# Altium schematic sheet 3_语音模块.schdoc.schdoc
size 309 x 223 mm; Symbol: Sheet-Symbol_A4; Device: Sheet-Symbol_A4; @Page Name: 语音模块; @Create Date: 2023-10-28; @Page Count: 4; @Page No: 2; @Project Name: New Project_2023-10-25_23-03-02; @Schematic Name: Schematic1; @Update Date: 2023-11-07; Company: 嘉立创EDA; Page Size: A4; Version: V1.0; SheetNumber: 2; SheetTotal: 4
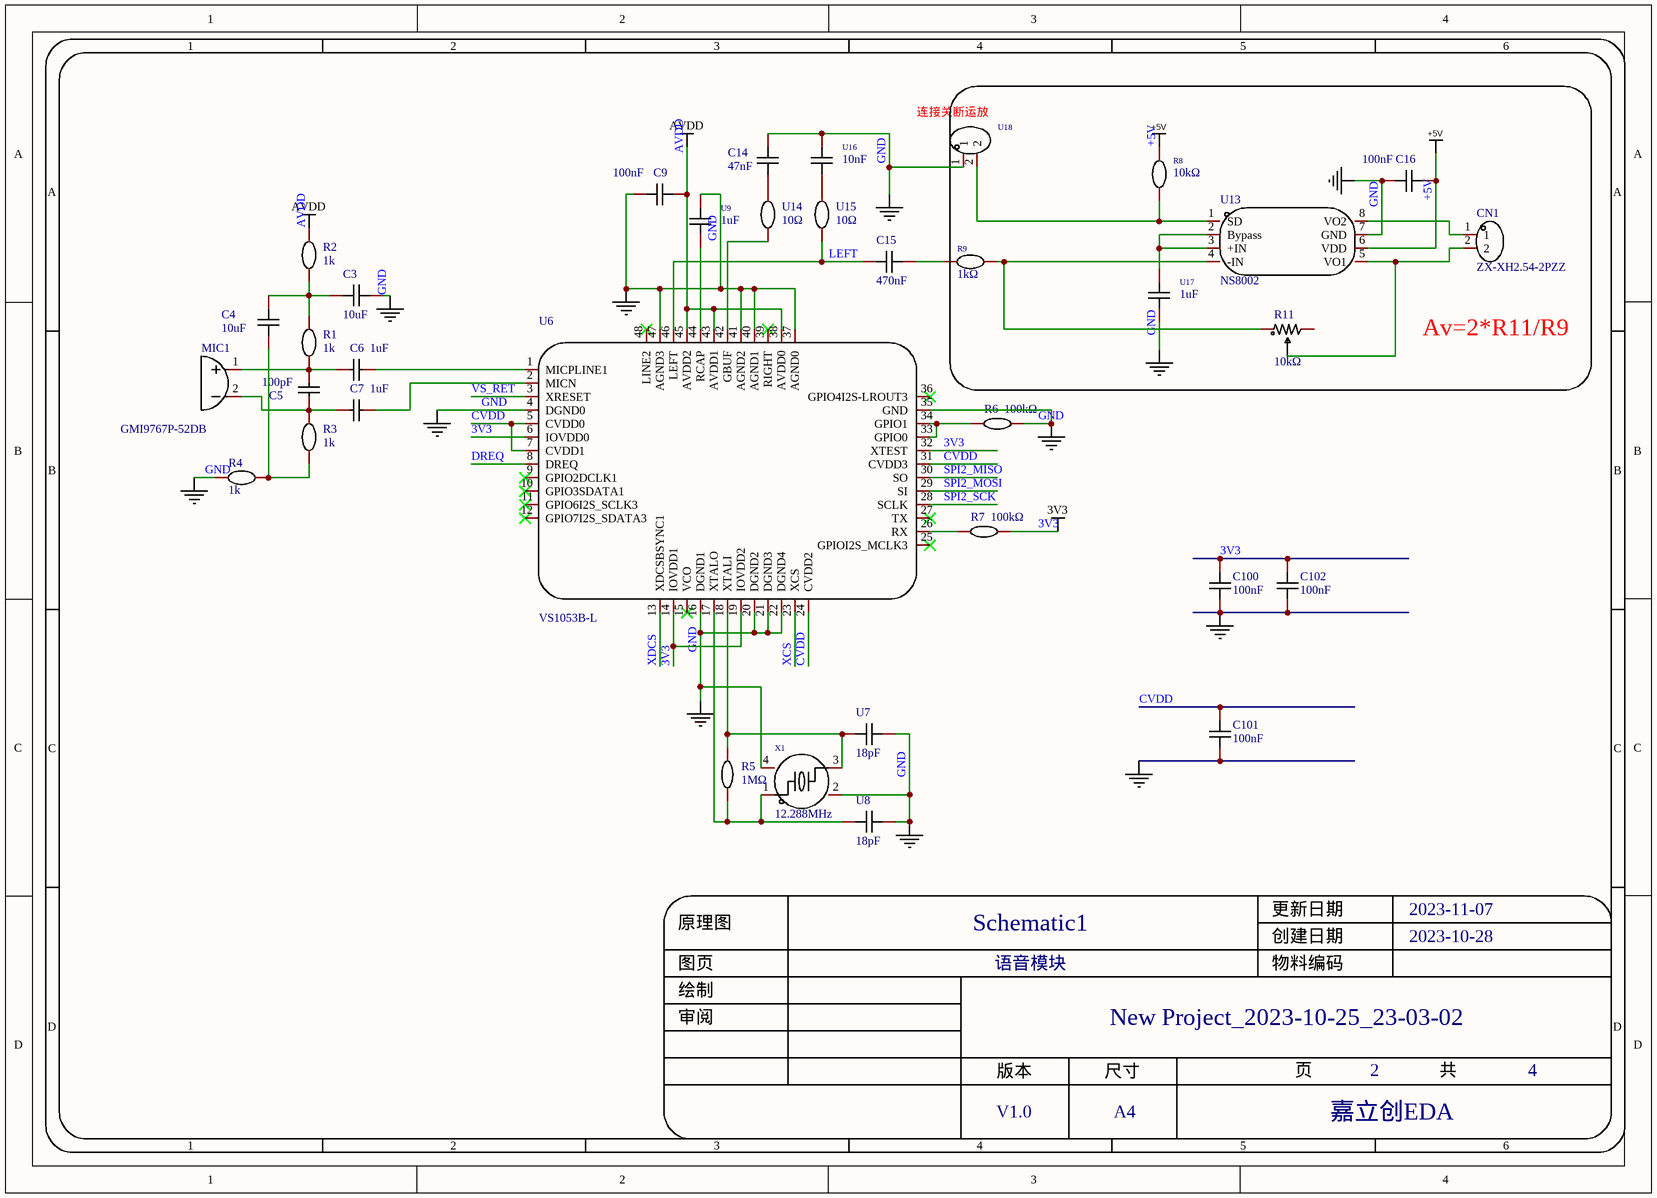
[diagram p0: 3_语音模块.schdoc.schdoc]

## Parts
C3  10uF  [C0603]
C4  10uF  [C0603]
C5  100pF  [C0603]
C6  1uF  [C0603]
C7  1uF  [C0603]
C9  100nF  [C0603]
C14  47nF  [C0603]
C15  470nF  [C0805]
C16  100nF  [C0603]
C100  100nF  [C0603]
C101  100nF  [C0603]
C102  100nF  [C0603]
CN1  ZX-XH2.54-2PZZ  [CONN-TH_2P-P2.50_HX25003-2A]
MIC1  GMI9767P-52DB  [MIC-TH_BD9.7-P2.54-D0.8-L-FD]
R1  1k  [R0603]
R2  1k  [R0603]
R3  1k  [R0603]
R4  1k  [R0603]
R5  1MΩ  [R0603]
R6  100kΩ  [R0603]
R7  100kΩ  [R0603]
R8  10kΩ  [R0603]
R9  1kΩ  [R0603]
R11  10kΩ  [RES-ADJ-TH_3362P]
U6  VS1053B-L  [LQFP-48_L7.0-W7.0-P0.50-LS9.0-BL]
U7  18pF  [C0603]
U8  18pF  [C0603]
U9  1uF  [C0603]
U13  NS8002  [SOP-8_L4.9-W3.9-P1.27-LS6.0-BL]
U14  10Ω  [R0603]
U15  10Ω  [R0603]
U16  10nF  [C0603]
U17  1uF  [C0603]
U18  PZ200-1-02-Z-C  [HDR-TH_2P-P2.00-V-M-3]  (value not drawn)
X1  12.288MHz  [CRYSTAL-SMD_4P-L3.2-W2.5-BL]

## Blocks framed on the sheet
Av=2*R11/R9: C16 CN1 R8 R9 R11 U13 U17 U18

## Nets
3V3: C100.1 C102.1 R7.2 U6.6(IOVDD0) U6.14(IOVDD1) U6.19(IOVDD2) U6.32(XTEST)
+5V: C16.1 R8.2 U13.6(VDD)
AVDD: C9.1 R2.2 U6.38(AVDD0) U6.43(AVDD1) U6.45(AVDD2)
GND: C3.2 C9.2 C14.2 C16.2 C100.2 C101.2 C102.2 R4.2 R6.2 U6.4(DGND0) U6.16(DGND1) U6.20(DGND2) U6.21(DGND3) U6.22(DGND4) U6.35(GND) U6.37(AGND0) U6.40(AGND1) U6.41(AGND2) U6.47(AGND3) U7.2 U8.2 U9.2 U13.7(GND) U16.2 U17.1 U18.1 X1.2(GND) X1.4(GND)
CVDD: C101.1 U6.5(CVDD0) U6.7(CVDD1) U6.24(CVDD2) U6.31(CVDD3)
DREQ: U6.8(DREQ)
LEFT: C15.1 U6.46(LEFT) U15.1
SPI2_MISO: U6.30(SO)
SPI2_MOSI: U6.29(SI)
SPI2_SCK: U6.28(SCLK)
VS_RET: U6.3(XRESET)
XCS: U6.23(XCS)
XDCS: U6.13(XDCSBSYNC1)
NetC3_1: C3.1 C4.2 R1.2 R2.1
NetC4_1: C4.1 R3.1 R4.1
NetC5_1: C5.1 C7.1 MIC1.2 R3.2
NetC5_2: C5.2 C6.1 MIC1.1 R1.1
NetC6_2: C6.2 U6.1(MICPLINE1)
NetC7_2: C7.2 U6.2(MICN)
NetC14_1: C14.1 U14.2
NetC15_2: C15.2 R9.1
NetCN1_1: CN1.1 U13.8(VO2)
NetCN1_2: CN1.2 R11.2 U13.5(VO1)
NetR5_1: R5.1 U6.17(XTALO) U8.1 X1.1
NetR5_2: R5.2 U6.18(XTALI) U7.1 X1.3
NetR6_1: R6.1 U6.33(GPIO0) U6.34(GPIO1)
NetR7_1: R7.1 U6.26(RX)
NetR8_1: R8.1 U13.1(SD) U18.2
NetR9_2: R9.2 R11.1 U13.4(-IN)
NetU6_42: U6.42(GBUF) U14.1
NetU6_44: U6.44(RCAP) U9.1
NetU13_2: U13.2(Bypass) U13.3(+IN) U17.2
NetU15_2: U15.2 U16.1

Not connected (* = marked no-connect by the designer): R11 3; U6 9(GPIO2DCLK1)* 10(GPIO3SDATA1)* 11(GPIO6I2S_SCLK3)* 12(GPIO7I2S_SDATA3)* 15(VCO)* 25(GPIOI2S_MCLK3)* 27(TX)* 36(GPIO4I2S-LROUT3)* 39(RIGHT)* 48(LINE2)*

## Notes on the sheet
- (near U18) 连接关断运放
- 1
- 2
- 3
- 4
- 5
- 6
- A
- B
- C
- 原理图
- Schematic1
- 创建日期
- 更新日期
- 2023-10-28
- 2023-11-07
- 审阅
- 绘制
- 图页
- 语音模块
- 物料编码
- New Project_2023-10-25_23-03-02
- D
- 版本
- 尺寸
- 页
- 共
- V1.0
- A4
- 嘉立创EDA

## Library data of the parts
C3 C4 = CL10A106MA8NRNC: 容值:10uF;精度:±20%;额定电压:25V;材质(温度系数):X5R;; Manufacturer: SAMSUNG(三星); Add into BOM: yes; Tolerance: ±20%; Voltage Rated: 25V; Temperature Coefficient: X5R; Name: 10uF; Symbol: CL10A106MA8NRNC; Device: CL10A106MA8NRNC; LCSC Part Name: 10uF ±20% 25V; Supplier Part: C96446; Manufacturer Part: CL10A106MA8NRNC; Supplier Footprint: 0603; JLCPCB Part Class: 基础库; Datasheet: https://atta.szlcsc.com/upload/public/pdf/source/20170325/1490427913016.pdf; Supplier: LCSC; Convert to PCB: yes; Value: 10uF
C5 = CL10C101JB8NNNC: 容值:100pF;精度:±5%;额定电压:50V;材质(温度系数):C0G;; Manufacturer: SAMSUNG(三星); Add into BOM: yes; Tolerance: ±5%; Voltage Rated: 50V; Temperature Coefficient: C0G; Name: 100pF; Symbol: CL10C101JB8NNNC; Device: CL10C101JB8NNNC; LCSC Part Name: 100pF ±5% 50V; Supplier Part: C14858; Manufacturer Part: CL10C101JB8NNNC; Supplier Footprint: 0603; JLCPCB Part Class: 基础库; Datasheet: https://atta.szlcsc.com/upload/public/pdf/source/20160103/1457707672333.pdf; Supplier: LCSC; Convert to PCB: yes; Value: 100pF
C6 C7 = CL10A105KB8NNNC: 容值:1uF;精度:±10%;额定电压:50V;材质(温度系数):X5R;; Manufacturer: SAMSUNG(三星); Add into BOM: yes; Tolerance: ±10%; Voltage Rated: 50V; Temperature Coefficient: X5R; Name: 1uF; Symbol: CL10A105KB8NNNC; Device: CL10A105KB8NNNC; LCSC Part Name: 1uF ±10% 50V; Supplier Part: C15849; Manufacturer Part: CL10A105KB8NNNC; Supplier Footprint: 0603; JLCPCB Part Class: 基础库; Datasheet: https://atta.szlcsc.com/upload/public/pdf/source/20160103/1457707679084.pdf; Supplier: LCSC; Convert to PCB: yes; Value: 1uF
C9 C16 C100-C102 = CGA3E3X8R1H104M080AE: 容值:100nF;精度:±20%;额定电压:50V;材质(温度系数):X8R;; Manufacturer: TDK; Add into BOM: yes; Tolerance: ±20%; Voltage Rated: 50V; Temperature Coefficient: X8R; Name: 100nF; Symbol: CGA3E3X8R1H104M080AE; Device: CGA3E3X8R1H104M080AE; LCSC Part Name: 100nF ±20% 50V; Supplier Part: C3855738; Manufacturer Part: CGA3E3X8R1H104M080AE; Supplier Footprint: 0603; Supplier: LCSC; Convert to PCB: yes; Value: 100nF
C14 = C1608X8R1H473K080AA: 容值:47nF;额定电压:50V;材质(温度系数):X8R;; Manufacturer: TDK; Add into BOM: yes; Voltage Rated: 50V; Temperature Coefficient: X8R; Name: 47nF; Symbol: C1608X8R1H473K080AA; Device: C1608X8R1H473K080AA; LCSC Part Name: 47nF 50V; Supplier Part: C3890694; Manufacturer Part: C1608X8R1H473K080AA; Supplier Footprint: 0603; Supplier: LCSC; Convert to PCB: yes; Value: 47nF
C15 = CC0805KKX7R0BB474: 容值:470nF;精度:±10%;额定电压:100V;材质(温度系数):X7R;; Manufacturer: YAGEO(国巨); Symbol: GRM21BR60E107ME15L; Add into BOM: yes; Tolerance: ±10%; Voltage Rated: 100V; Temperature Coefficient: X7R; Name: 470nF; Device: CC0805KKX7R0BB474; LCSC Part Name: 470nF ±10% 100V; Supplier Part: C596323; Manufacturer Part: CC0805KKX7R0BB474; Supplier Footprint: 0805; JLCPCB Part Class: Extended Part; Datasheet: https://atta.szlcsc.com/upload/public/pdf/source/20200609/C596323_82E7DD20666BC3809E26A1262184D295.pdf; Supplier: LCSC; Convert to PCB: yes; Value: 470nF
CN1 = ZX-XH2.54-2PZZ: 参考系列:XH;间距:2.54mm;插针结构:1x2P;排数:1;每排PIN数:2;行距:-;公母:公型插针;安装方式:直插;额定电流:3A;触头材质:黄铜;触头镀层:锡;工作温度范围:-25℃~+85℃;焊接温度(最大值):260℃;; Manufacturer: Megastar(兆星); Add into BOM: yes; Reference Series: XH; Pitch: 2.54mm; Pins Structure: 1x2P; Number of PINs Per Row: 2; Gender: 公型插针; Current Rating (Max): 3A; Welding Temperature (Max): 260℃; Name: ZX-XH2.54-2PZZ; Symbol: ZX-XH2.54-2PZZ; Device: ZX-XH2.54-2PZZ; LCSC Part Name: 系列:XH 间距:2.54mm 1x2P 直插; Supplier Part: C7429632; Manufacturer Part: ZX-XH2.54-2PZZ; Supplier Footprint: 插件,P=2.54mm; JLCPCB Part Class: 扩展库; Datasheet: https://atta.szlcsc.com/upload/public/pdf/source/20230619/19BA6947230AA44A04D3EDD65E618FD0.pdf; Supplier: LCSC; Convert to PCB: yes; Number of Rows: 1; Row Spacing: -; Mounting Style: 直插; Contact Material: 黄铜; Contact Plating: 锡; Operating Temperature Range: -25℃~+85℃
MIC1 = GMI9767P-52DB: Manufacturer: INGHAi(赢海); Add into BOM: yes; Name: GMI9767P-52DB; Symbol: GMI9767P-52DB; Device: GMI9767P-52DB; LCSC Part Name: 全指向φ9.7*6.7mm 1.5V-10V 灵敏度-52db 低阻抗 针脚; Supplier Part: C234023; Manufacturer Part: GMI9767P-52DB; Supplier Footprint: 插件; JLCPCB Part Class: 扩展库; Datasheet: https://atta.szlcsc.com/upload/public/pdf/source/20200113/C234023_1CE1EA91B70FB2D654251C10F12F6FAC.pdf; Supplier: LCSC; Convert to PCB: yes
R1-R4 = 1k: Add into BOM: yes; Name: 1k; Symbol: 1K; Device: 1k; LCSC Part Name: 1k; Supplier Part: C9900012840; Manufacturer Part: 1k; Supplier Footprint: R0603; JLCPCB Part Class: 扩展库; Supplier: LCSC; Convert to PCB: yes
R5 = 0603WAF1004T5E: 电阻类型:厚膜电阻;阻值:1MΩ;精度:±1%;功率:100mW;温度系数:±100ppm/℃;; Manufacturer: UNI-ROYAL(厚声); Add into BOM: yes; Tolerance: ±1%; Power(Watts): 100mW; Overload Voltage (Max): 75V; Name: 1MΩ; Symbol: 0603WAF1004T5E; Device: 0603WAF1004T5E; LCSC Part Name: 厚膜电阻 1MΩ ±1% 100mW; Supplier Part: C22935; Manufacturer Part: 0603WAF1004T5E; Supplier Footprint: 0603; JLCPCB Part Class: 基础库; Datasheet: https://atta.szlcsc.com/upload/public/pdf/source/20200306/C422600_1E6D84923E4A46A82E41ADD87F860B5C.pdf; Supplier: LCSC; Convert to PCB: yes; Type: 厚膜电阻; Value: 1MΩ; Temperature Coefficient: ±100ppm/℃; Operating Temperature Range: -55℃~+155℃
R6 R7 = ERJ3EKF1003V: 电阻类型:厚膜电阻;阻值:100kΩ;精度:±1%;功率:100mW;温度系数:±100ppm/℃;; Manufacturer: PANASONIC(松下); Add into BOM: yes; Tolerance: ±1%; Power(Watts): 100mW; Name: 100kΩ; Symbol: ERJ3EKF1003V; Device: ERJ3EKF1003V; LCSC Part Name: 厚膜电阻 100kΩ ±1% 100mW; Supplier Part: C189597; Manufacturer Part: ERJ3EKF1003V; Supplier Footprint: 0603; JLCPCB Part Class: 扩展库; Datasheet: https://atta.szlcsc.com/upload/public/pdf/source/20180524/C193239_FFEA89BB7F9859C8C42240F47AD03C60.pdf; Supplier: LCSC; Convert to PCB: yes; Type: 厚膜电阻; Value: 100kΩ; Temperature Coefficient: ±100ppm/℃; Overload Voltage (Max): -; Operating Temperature Range: -55℃~+155℃
R8 = SCR0603J10K: 阻值:10kΩ;精度:±5%;; Manufacturer: VO(翔胜); Add into BOM: yes; Tolerance: ±5%; Name: 10kΩ; Symbol: SCR0603J10K; Device: SCR0603J10K; LCSC Part Name: 10kΩ ±5%; Supplier Part: C3017715; Manufacturer Part: SCR0603J10K; Supplier Footprint: 0603; JLCPCB Part Class: 扩展库; Datasheet: https://atta.szlcsc.com/upload/public/pdf/source/20220513/247AF9639BA21CF93567DC289CCC6A22.pdf; Supplier: LCSC; Convert to PCB: yes; Value: 10kΩ
R9 = SCR0603F1K: 阻值:1kΩ;精度:±1%;; Manufacturer: VO(翔胜); Add into BOM: yes; Tolerance: ±1%; Name: 1kΩ; Symbol: SCR0603F1K; Device: SCR0603F1K; LCSC Part Name: 1kΩ ±1%; Supplier Part: C3016283; Manufacturer Part: SCR0603F1K; Supplier Footprint: 0603; JLCPCB Part Class: 扩展库; Datasheet: https://atta.szlcsc.com/upload/public/pdf/source/20220513/247AF9639BA21CF93567DC289CCC6A22.pdf; Supplier: LCSC; Convert to PCB: yes; Value: 1kΩ
R11 = 3362P-1-103: 阻值:10kΩ;精度:±10%;; Manufacturer: BOCHEN(博晨); Symbol: 3362P-1-103_C118956; Add into BOM: yes; Tolerance: ±10%; Name: 10kΩ; Device: 3362P-1-103; LCSC Part Name: 10kΩ ±10%; Supplier Part: C118956; Manufacturer Part: 3362P-1-103; Supplier Footprint: 插件; JLCPCB Part Class: 扩展库; Datasheet: https://atta.szlcsc.com/upload/public/pdf/source/20171114/C118956_15106326650691117445.pdf; Supplier: LCSC; Convert to PCB: yes; Value: 10kΩ
U6 = VS1053B-L: MP3芯片; Manufacturer: VLSI; Add into BOM: yes; Name: VS1053B-L; Symbol: VS1053B; Device: VS1053B-L; LCSC Part Name: VS1053B-L; Supplier Part: C9922; Manufacturer Part: VS1053B-L; Supplier Footprint: LQFP-48(7x7); JLCPCB Part Class: 扩展库; Datasheet: https://atta.szlcsc.com/upload/public/pdf/source/20121114/1457706558124.pdf; Supplier: LCSC; Convert to PCB: yes
U7 U8 = C1608CH2A180J080AA: 容值:18pF;精度:±5%;额定电压:100V;材质(温度系数):CH;; Manufacturer: TDK; Add into BOM: yes; Tolerance: ±5%; Voltage Rated: 100V; Temperature Coefficient: CH; Name: 18pF; Symbol: C1608CH2A180J080AA; Device: C1608CH2A180J080AA; LCSC Part Name: 18pF ±5% 100V; Supplier Part: C3847790; Manufacturer Part: C1608CH2A180J080AA; Supplier Footprint: -; JLCPCB Part Class: 扩展库; Supplier: LCSC; Convert to PCB: yes; Value: 18pF
U9 U17 = CGA3E3X5R1V105M080AB: 容值:1uF;精度:±20%;额定电压:35V;材质(温度系数):X5R;; Manufacturer: TDK; Add into BOM: yes; Tolerance: ±20%; Voltage Rated: 35V; Temperature Coefficient: X5R; Name: 1uF; Symbol: CGA3E3X5R1V105M080AB; Device: CGA3E3X5R1V105M080AB; LCSC Part Name: 1uF ±20% 35V; Supplier Part: C3910162; Manufacturer Part: CGA3E3X5R1V105M080AB; Supplier Footprint: 0603; Supplier: LCSC; Convert to PCB: yes; Value: 1uF
U13 = NS8002: 音频功率放大器的类型:Class AB;输出类型:-;输出功率:1.8W x 1 @ 4Ω;工作电压:3V ~ 5.25V;; Manufacturer: Nsiway(纳芯威); Add into BOM: yes; Name: NS8002; Symbol: NS8002; Device: NS8002; LCSC Part Name: NS8002; Supplier Part: C189960; Manufacturer Part: NS8002; Supplier Footprint: SOP-8-EP-150mil; JLCPCB Part Class: 扩展库; Datasheet: https://atta.szlcsc.com/upload/public/pdf/source/20190704/C189960_42E000A0092060C3B2B5B31BC13BD104.pdf; Supplier: LCSC; Convert to PCB: yes; Type: Class AB; Output Type: -; Max Output Power x Channels @ Load: 1.8W x 1 @ 4Ω; Voltage - Supply: 3V ~ 5.25V; Features: 关机
U14 U15 = PCAN0603E10R0BST5: 电阻类型:薄膜电阻;阻值:10Ω;精度:±0.1%;功率:500mW;; Manufacturer: VISHAY(威世); Add into BOM: yes; Tolerance: ±0.1%; Power(Watts): 500mW; Temperature Coefficient: ±25ppm/℃; Overload Voltage (Max): 75V; Name: 10Ω; Symbol: PCAN0603E10R0BST5; Device: PCAN0603E10R0BST5; LCSC Part Name: 10Ω ±0.1% 500mW; Supplier Part: C2091258; Manufacturer Part: PCAN0603E10R0BST5; Supplier Footprint: 0603; JLCPCB Part Class: 扩展库; Datasheet: https://atta.szlcsc.com/upload/public/pdf/source/20210606/BB102AFC1F3ADA31AF003395293DA88D.pdf; Supplier: LCSC; Convert to PCB: yes; Type: 薄膜电阻; Value: 10Ω; Operating Temperature Range: -55℃~+155℃
U16 = C1608X8R2A103K080AA: 容值:10nF;精度:±10%;额定电压:100V;材质(温度系数):X8R;; Manufacturer: TDK; Add into BOM: yes; Tolerance: ±10%; Voltage Rated: 100V; Temperature Coefficient: X8R; Name: 10nF; Symbol: C1608X8R2A103K080AA; Device: C1608X8R2A103K080AA; LCSC Part Name: 10nF ±10% 100V; Supplier Part: C3865495; Manufacturer Part: C1608X8R2A103K080AA; Supplier Footprint: 0603; Supplier: LCSC; Convert to PCB: yes; Value: 10nF
U18 = PZ200-1-02-Z-C: 间距：2.0mm 总PIN位数：2 排数1行距：2.0mm 安类型：直插 圆针：圆针 额定电流：3A 配合针长度：3.7mm 塑高：3mm 端接针长度：3.7mm 触头材质：黄铜 触头镀层：金 工作温度范围：-40℃~+105℃ 焊接温度(最大值)：260℃ 颜色：黑; Manufacturer: HCTL(华灿天禄); Add into BOM: yes; Name: PZ200-1-02-Z-C; Symbol: PZ200-1-02-Z-C; Device: PZ200-1-02-Z-C; LCSC Part Name: PZ200-1-02-Z-C; Supplier Part: C5159793; Manufacturer Part: PZ200-1-02-Z-C; Supplier Footprint: 插件,P=2mm; JLCPCB Part Class: 扩展库; Datasheet: https://atta.szlcsc.com/upload/public/pdf/source/20230609/CA4823EE069156B840028BF818EA617F.pdf; Supplier: LCSC; Convert to PCB: yes
X1 = SX3B12.288F2010F30: 频率:12.288MHz;频率公差:±10ppm;负载电容:20pF;; Manufacturer: SCTF(星通时频); Add into BOM: yes; Crystal Type: 贴片无源晶振; Frequency Tolerance: ±10ppm; Frequency Stability: ±30ppm; Load Capacitance: 20pF; Equivalent Series Resistance (ESR): 100Ω; Name: 12.288MHz; Symbol: SX3B12.288F2010F30; Device: SX3B12.288F2010F30; LCSC Part Name: 12.288MHz ±10ppm 20pF; Supplier Part: C2901655; Manufacturer Part: SX3B12.288F2010F30; Supplier Footprint: SMD3225-4P; JLCPCB Part Class: 扩展库; Datasheet: https://atta.szlcsc.com/upload/public/pdf/source/20211009/3804C1E26C475A85A55BFB80BFD4FE9A.pdf; Supplier: LCSC; Convert to PCB: yes; Value: 12.288MHz; Operating Temperature: -40℃~+85℃